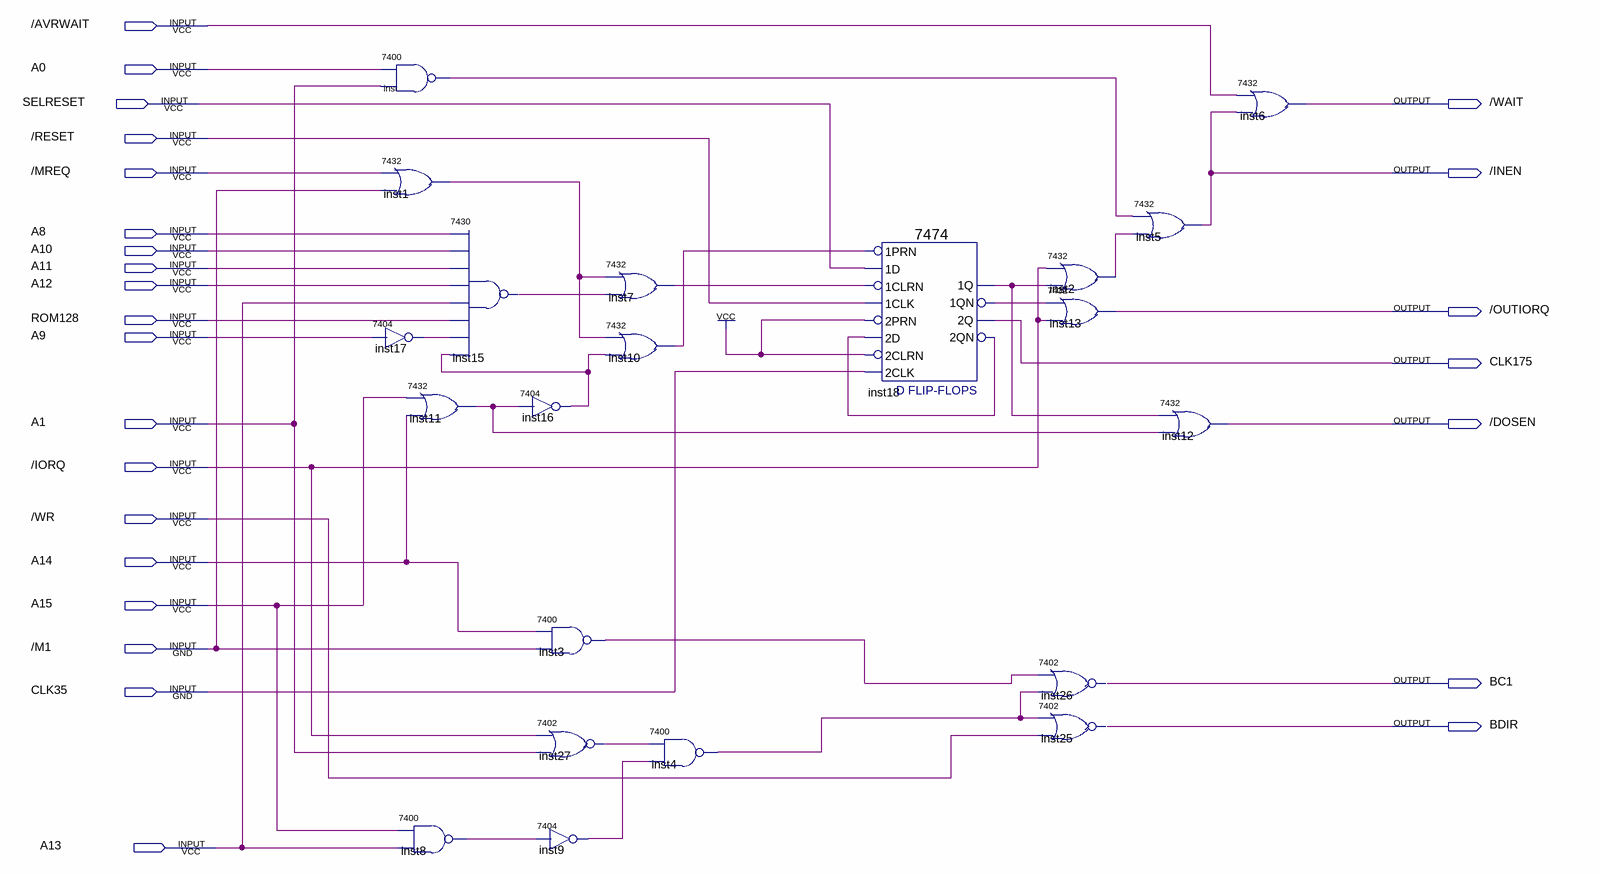
[diagram p0: schematic sheet]
// Quartus schematic FDCemu_CPLD.bdf as structural Verilog: 21 symbols, 26 pins
module FDCemu_CPLD (
  input  \/AVRWAIT ,
  input  A0,
  input  SELRESET,
  input  \/RESET ,
  input  \/MREQ ,
  input  A8,
  input  A10,
  input  A11,
  input  A12,
  input  ROM128,
  input  A9,
  input  A1,
  input  \/IORQ ,
  input  \/WR ,
  input  A14,
  input  A15,
  input  \/M1 ,
  input  CLK35,
  input  A13,
  output \/WAIT ,
  output \/INEN ,
  output \/OUTIORQ ,
  output CLK175,
  output \/DOSEN ,
  output BC1,
  output BDIR
);

  wire inst1_1, inst2_1, inst3_1, inst4_1, inst7_1, inst8_1, inst9_1, inst10_1, inst11_1, inst15_1, inst16_1,
       inst17_1, inst18_1q, inst18_1qn, inst18_2qn, inst27_1, inst_1;

  \7400  inst (.\3 (A1), .\2 (A0), .\1 (inst_1));
  \7432  inst1 (.\2 (\/MREQ ), .\3 (\/M1 ), .\1 (inst1_1));
  \7404  inst17 (.\2 (A9), .\1 (inst17_1));
  \7432  inst11 (.\2 (A15), .\3 (A14), .\1 (inst11_1));
  \7400  inst8 (.\3 (A13), .\2 (A15), .\1 (inst8_1));
  \7430  inst15 (
    .\9 (inst16_1), .\7 (ROM128), .\8 (inst17_1), .\5 (A12), .\2 (A8), .\6 (A13), .\3 (A10), .\4 (A11),
    .\1 (inst15_1));
  \7404  inst16 (.\2 (inst11_1), .\1 (inst16_1));
  \7400  inst3 (.\3 (\/M1 ), .\2 (A14), .\1 (inst3_1));
  \7402  inst27 (.\2 (\/IORQ ), .\3 (A1), .\1 (inst27_1));
  \7404  inst9 (.\2 (inst8_1), .\1 (inst9_1));
  \7432  inst7 (.\2 (inst1_1), .\3 (inst15_1), .\1 (inst7_1));
  \7432  inst10 (.\2 (inst1_1), .\3 (inst16_1), .\1 (inst10_1));
  \7400  inst4 (.\3 (inst9_1), .\2 (inst27_1), .\1 (inst4_1));
  \7474  inst18 (
    .\2D (inst18_2qn), .\2PRN (1'b1), .\1CLK (\/RESET ), .\1D (SELRESET), .\1PRN (inst10_1), .\2CLK (CLK35),
    .\2CLRN (1'b1), .\1CLRN (inst7_1), .\1QN (inst18_1qn), .\2Q (CLK175), .\2QN (inst18_2qn), .\1Q (inst18_1q));
  \7432  inst2 (.\2 (\/IORQ ), .\3 (inst18_1q), .\1 (inst2_1));
  \7432  inst13 (.\2 (inst18_1qn), .\3 (\/IORQ ), .\1 (\/OUTIORQ ));
  \7402  inst26 (.\2 (inst3_1), .\3 (inst4_1), .\1 (BC1));
  \7402  inst25 (.\2 (inst4_1), .\3 (\/WR ), .\1 (BDIR));
  \7432  inst5 (.\2 (inst_1), .\3 (inst2_1), .\1 (\/INEN ));
  \7432  inst12 (.\2 (inst18_1q), .\3 (inst11_1), .\1 (\/DOSEN ));
  \7432  inst6 (.\2 (\/AVRWAIT ), .\3 (\/INEN ), .\1 (\/WAIT ));
endmodule
